# Altium schematic sheet P05 Power2.SchDoc
size 420 x 297 mm
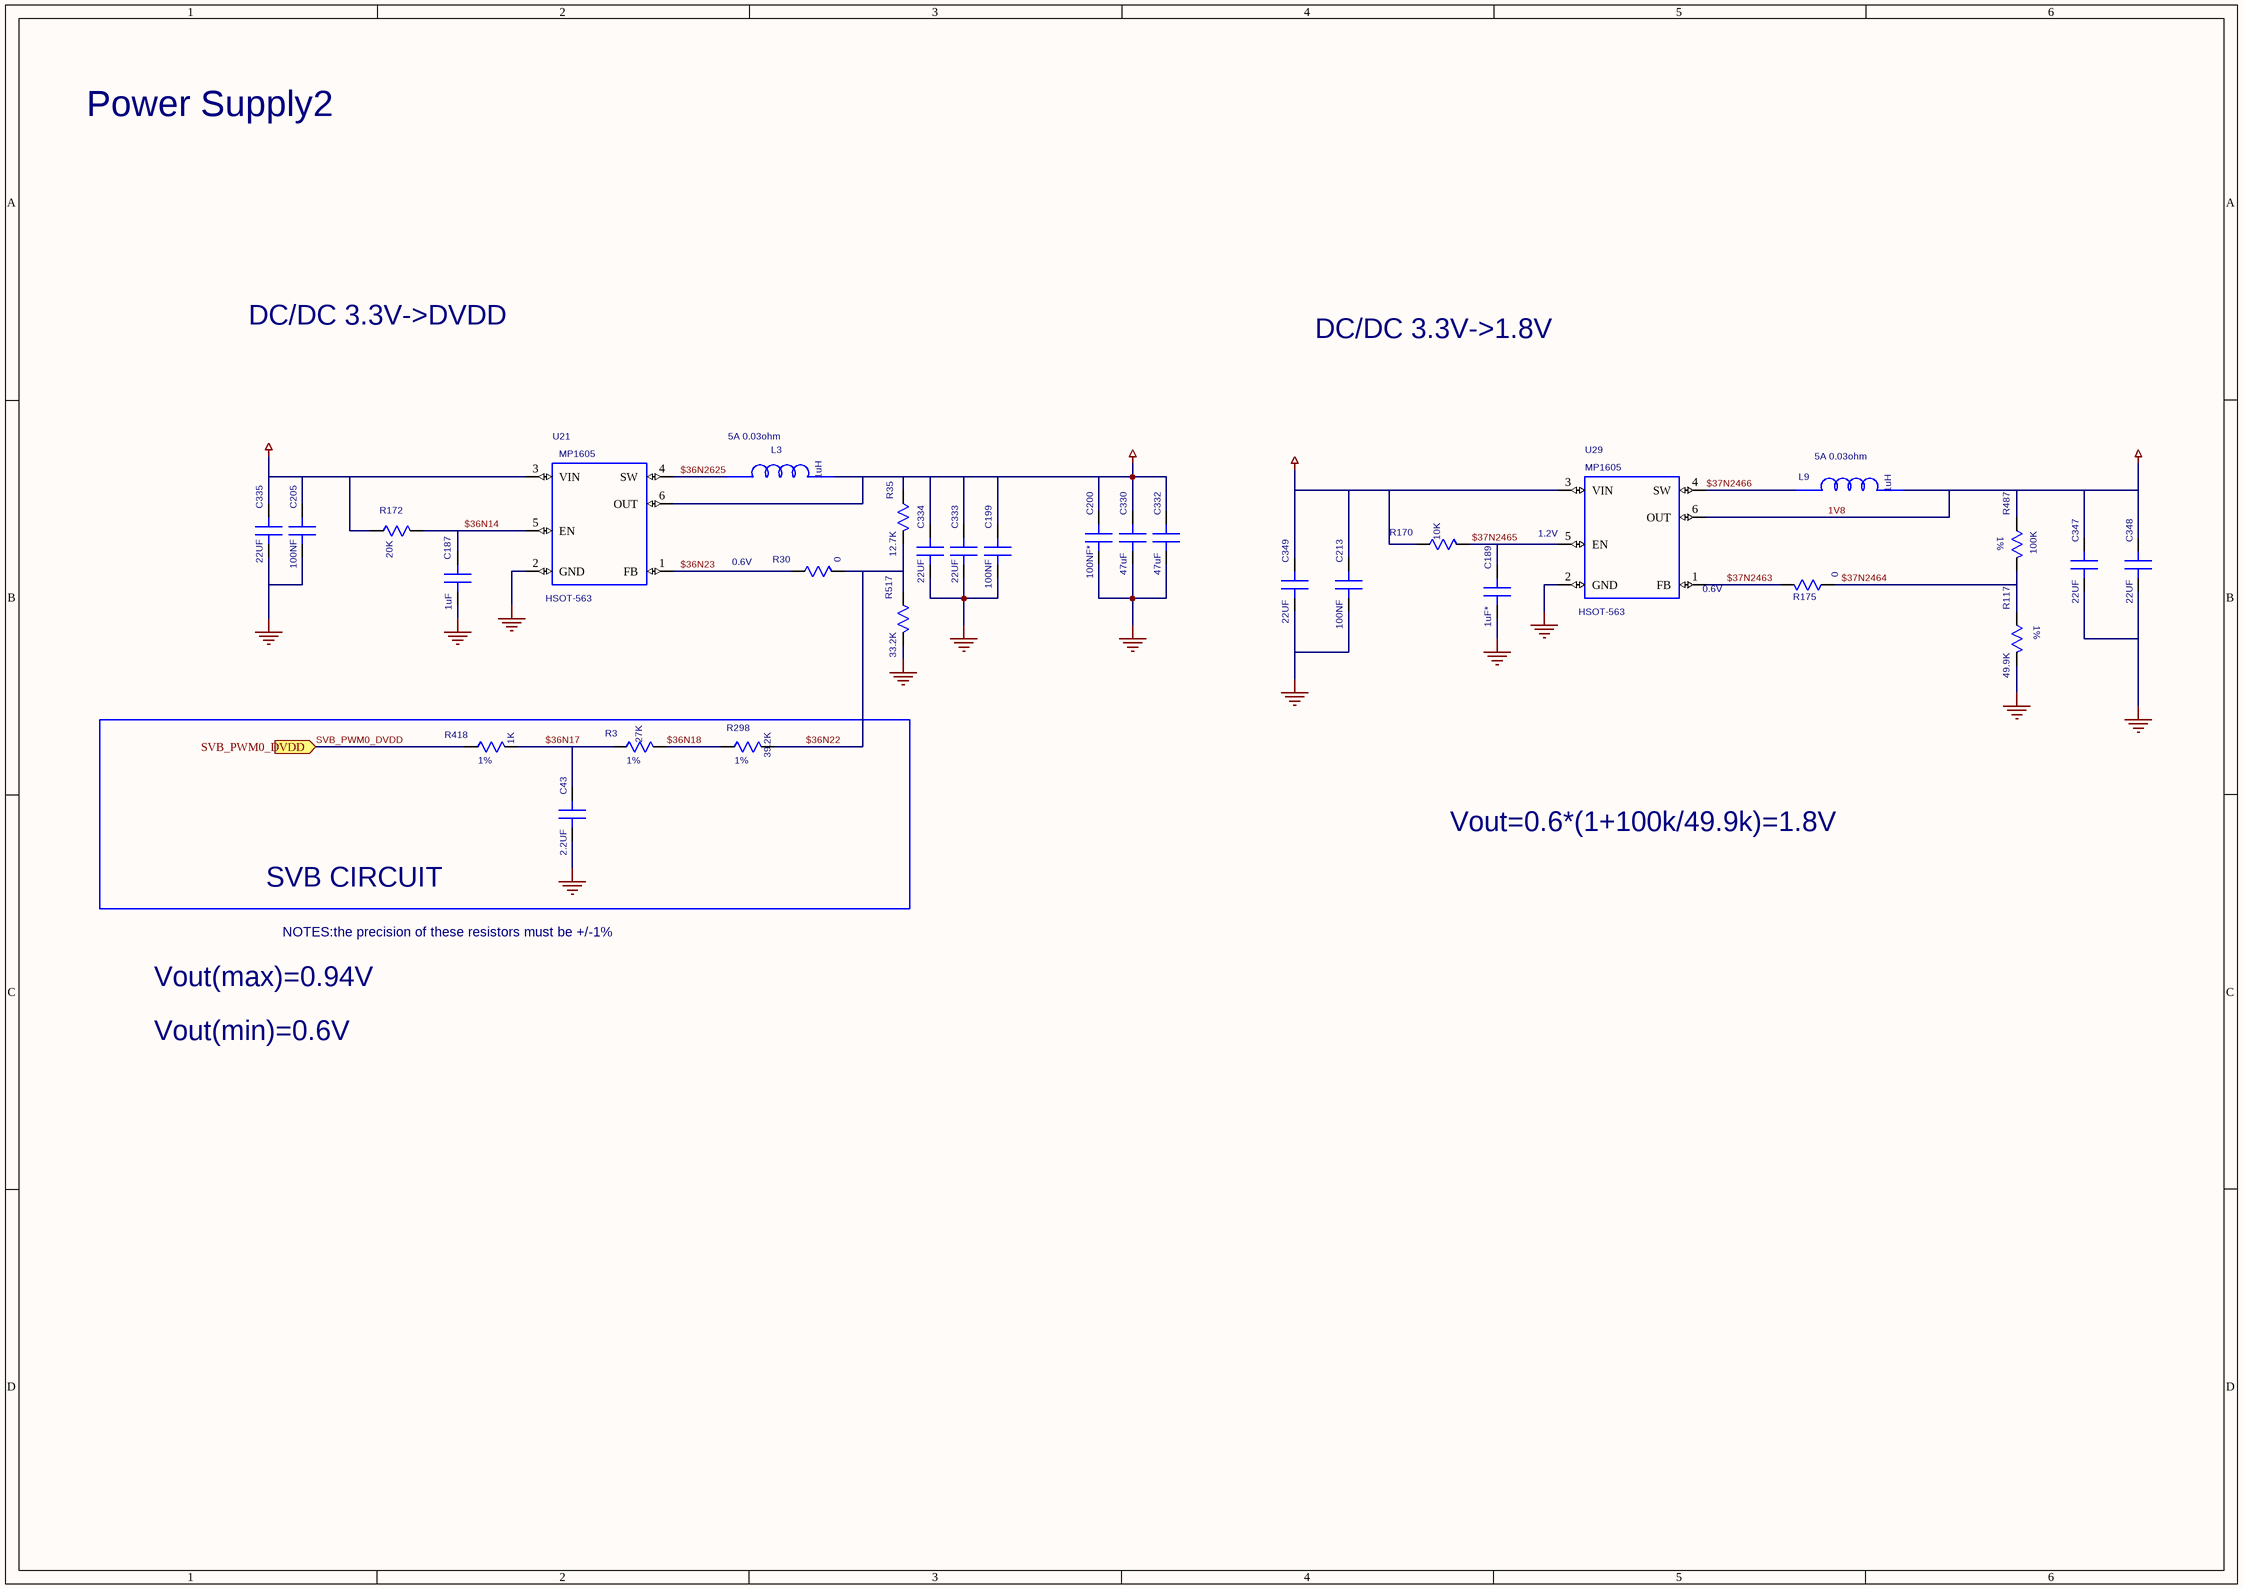
[diagram p0: P05 Power2.SchDoc]

## Parts
C43  2.2UF  [HSC0402]
C187  1uF  [SC0402]
C189  1uF*  [SC0402]
C199  100NF  [SC0402]
C200  100NF*  [SC0402]
C205  100NF  [SC0402]
C213  100NF  [SC0402]
C330  47uF  [SC1206]
C332  47uF  [SC1206]
C333  22UF  [SC1206]
C334  22UF  [SC1206]
C335  22UF  [SC1206]
C347  22UF  [SC1206]
C348  22UF  [SC1206]
C349  22UF  [SC1206]
L3  1uH  [SL1008H]
L9  1uH  [SL1008H]
R3  27K  [SR0603]
R30  0  [SR0402]
R35  12.7K  [SR0603]
R117  49.9K  [SR0402]
R170  10K  [SR0402]
R172  20K  [SR0402]
R175  0  [SR0402]
R298  39.2K  [SR0402]
R418  1K  [SR0402]
R487  100K  [SR0402]
R517  33.2K  [SR0603]
U21  MP1605  [HSOT-563]
U29  MP1605  [HSOT-563]

## Blocks framed on the sheet
SVB CIRCUIT: C43 R3 R298 R418

## Ports
SVB_PWM0_DVDD

## Nets
1V8: C347.1(A) C348.1(A) L9.2(B) R487.1(A) U29.6(OUT)
3V3: C205.1(A) C213.1(A) C335.1(A) C349.1(A) R170.1(A) R172.1(A) U21.3(VIN) U29.3(VIN)
DVDD: C199.1(A) C200.1(A) C330.1(A) C332.1(A) C333.1(A) C334.1(A) L3.2(B) R35.1(A) U21.6(OUT)
GND: C43.2(B) C187.2(B) C189.2(B) C199.2(B) C200.2(B) C205.2(B) C213.2(B) C330.2(B) C332.2(B) C333.2(B) C334.2(B) C335.2(B) C347.2(B) C348.2(B) C349.2(B) R117.2(B) R517.2(B) U21.2(GND) U29.2(GND)
$36N14: C187.1(A) R172.2(B) U21.5(EN)
$36N17: C43.1(A) R3.1(A) R418.2(B)
$36N18: R3.2(B) R298.1(A)
$36N22: R30.2(B) R35.2(B) R298.2(B) R517.1(A)
$36N23: R30.1(A) U21.1(FB)
$36N2625: L3.1(A) U21.4(SW)
$37N2463: R175.2(B) U29.1(FB)
$37N2464: R117.1(A) R175.1(A) R487.2(B)
$37N2465: C189.1(A) R170.2(B) U29.5(EN)
$37N2466: L9.1(A) U29.4(SW)
SVB_PWM0_DVDD: R418.1(A) ; port SVB_PWM0_DVDD

## Notes on the sheet
- Power Supply2
- DC/DC 3.3V->DVDD
- DC/DC 3.3V->1.8V
- (near L3) 5A 0.03ohm
- (near L9) 5A 0.03ohm
- (near R487) 1%
- 0.6V
- (near U29) 1.2V
- (near U29) 0.6V
- (near R117) 1%
- (near R418) 1%
- (near R3) 1%
- (near R298) 1%
- Vout=0.6*(1+100k/49.9k)=1.8V
- NOTES:the precision of these resistors must be +/-1%
- Vout(max)=0.94V
- Vout(min)=0.6V

## Library data of the parts
C43 = C: PARTS: 1; OriginalSymbolOrigin: (0,0); DEVICE: GRM155C70J225KE11D; LEVEL: STD; PINSWAP: (A,B); COMPONENT_HIGH_MAX: 0.7mm; %182%%238%%182%%168%%185%%164%%215%%247%%181%%231%%209%%185%(V): 6.3; CODE: 8071990; %195%%232%%202%%246%: SMD陶瓷电容-6.3V-2200nF-+/-10%-X7S-0402; %208%%161%%192%%224%%195%%251%%179%%198%: SMD陶瓷电容; PKG_TYPE: HSC0402
C187 = C: PARTS: 1; OriginalSymbolOrigin: (0,0); DEVICE: C1005X6S1A105KT000F; LEVEL: STD; PINSWAP: (A,B); %208%%161%%192%%224%%195%%251%%179%%198%: SMD陶瓷电容; COMPONENT_HIGH_MAX: 0.6mm; %182%%238%%182%%168%%185%%164%%215%%247%%181%%231%%209%%185%(V): 10; %195%%232%%202%%246%: SMD陶瓷电容-10V-1000nF-+/-10%-X6S-0402; CODE: 8071747; PKG_TYPE: SC0402
C189 = C: PARTS: 1; OriginalSymbolOrigin: (0,0); DEVICE: C1005X6S1A105KT000F; LEVEL: STD; PINSWAP: (A,B); CODE: 8071747; %195%%232%%202%%246%: SMD陶瓷电容-10V-1000nF-+/-10%-X6S-0402; %182%%238%%182%%168%%185%%164%%215%%247%%181%%231%%209%%185%(V): 10; COMPONENT_HIGH_MAX: 0.6mm; %208%%161%%192%%224%%195%%251%%179%%198%: SMD陶瓷电容; VARIANT_ID: $37I3361; PKG_TYPE: SC0402
C199 = C: PARTS: 1; OriginalSymbolOrigin: (0,0); DEVICE: RMEMK105BJ104KV_FR; LEVEL: STD; PINSWAP: (A,B); COMPONENT_HIGH_MAX: 0.55mm; %182%%238%%182%%168%%185%%164%%215%%247%%181%%231%%209%%185%(V): 16; CODE: 8070614; %195%%232%%202%%246%: SMD陶瓷电容-16V-100nF-+/-10%-X7R-0402-BT; %208%%161%%192%%224%%195%%251%%179%%198%: SMD陶瓷电容; PKG_TYPE: SC0402
C200 = C: PARTS: 1; OriginalSymbolOrigin: (0,0); DEVICE: RMEMK105BJ104KV_FR; LEVEL: STD; PINSWAP: (A,B); %182%%238%%182%%168%%185%%164%%215%%247%%181%%231%%209%%185%(V): 16; COMPONENT_HIGH_MAX: 0.55mm; CODE: 8070614; %195%%232%%202%%246%: SMD陶瓷电容-16V-100nF-+/-10%-X7R-0402-BT; %208%%161%%192%%224%%195%%251%%179%%198%: SMD陶瓷电容; VARIANT_ID: $36I1144; PKG_TYPE: SC0402
C205 = C: PARTS: 1; OriginalSymbolOrigin: (0,0); DEVICE: RMEMK105BJ104KV_FR; LEVEL: STD; PINSWAP: (A,B); %182%%238%%182%%168%%185%%164%%215%%247%%181%%231%%209%%185%(V): 16; COMPONENT_HIGH_MAX: 0.55MM; CODE: 8070614; %195%%232%%202%%246%: SMD陶瓷电容-16V-100NF-+/-10%-X7R-0402-BT; %208%%161%%192%%224%%195%%251%%179%%198%: SMD陶瓷电容; PKG_TYPE: SC0402
C213 = C: PARTS: 1; OriginalSymbolOrigin: (0,0); DEVICE: RMEMK105BJ104KV_FR; LEVEL: STD; PINSWAP: (A,B); %208%%161%%192%%224%%195%%251%%179%%198%: SMD陶瓷电容; CODE: 8070614; %195%%232%%202%%246%: SMD陶瓷电容-16V-100nF-+/-10%-X7R-0402-BT; %182%%238%%182%%168%%185%%164%%215%%247%%181%%231%%209%%185%(V): 16; COMPONENT_HIGH_MAX: 100000000MM; PKG_TYPE: SC0402
C330 C332 = C: PARTS: 1; OriginalSymbolOrigin: (0,0); DEVICE: C3216X6S0J476MTJ00N; LEVEL: STD; PINSWAP: (A,B); CODE: 8071639; %195%%232%%202%%246%: SMD陶瓷电容-6.3V-47000nF-+/-20%-X6S-1206-供电专用; %182%%238%%182%%168%%185%%164%%215%%247%%181%%231%%209%%185%(V): 6.3; COMPONENT_HIGH_MAX: 1.8MM; %208%%161%%192%%224%%195%%251%%179%%198%: SMD陶瓷电容; PKG_TYPE: SC1206
C333 C334 = C: PARTS: 1; OriginalSymbolOrigin: (0,0); DEVICE: CEJMK316B7226ML_T; LEVEL: STD; PINSWAP: (A,B); COMPONENT_HIGH_MAX: 1.8mm; %182%%238%%182%%168%%185%%164%%215%%247%%181%%231%%209%%185%(V): 6.3; CODE: 8070862; %195%%232%%202%%246%: SMD陶瓷电容-6.3V-22000nF-+/-20%-X7R-1206-所有; %208%%161%%192%%224%%195%%251%%179%%198%: SMD陶瓷电容; PKG_TYPE: SC1206
C335 = C: PARTS: 1; OriginalSymbolOrigin: (0,0); DEVICE: CEJMK316B7226ML_T; LEVEL: STD; PINSWAP: (A,B); %182%%238%%182%%168%%185%%164%%215%%247%%181%%231%%209%%185%(V): 6.3; COMPONENT_HIGH_MAX: 1.8mm; CODE: 8070862; %195%%232%%202%%246%: SMD陶瓷电容-6.3V-22000nF-+/-20%-X7R-1206-所有; %208%%161%%192%%224%%195%%251%%179%%198%: SMD陶瓷电容; PKG_TYPE: SC1206
C347 C349 = C: PARTS: 1; OriginalSymbolOrigin: (0,0); DEVICE: CEJMK316B7226ML_T; LEVEL: STD; PINSWAP: (A,B); %208%%161%%192%%224%%195%%251%%179%%198%: SMD陶瓷电容; COMPONENT_HIGH_MAX: 1.8mm; %182%%238%%182%%168%%185%%164%%215%%247%%181%%231%%209%%185%(V): 6.3; %195%%232%%202%%246%: SMD陶瓷电容-6.3V-22000nF-+/-20%-X7R-1206-所有; CODE: 8070862; PKG_TYPE: SC1206
C348 = C: PARTS: 1; OriginalSymbolOrigin: (0,0); DEVICE: CEJMK316B7226ML_T; LEVEL: STD; PINSWAP: (A,B); CODE: 8070862; %195%%232%%202%%246%: SMD陶瓷电容-6.3V-22000nF-+/-20%-X7R-1206-所有; %182%%238%%182%%168%%185%%164%%215%%247%%181%%231%%209%%185%(V): 6.3; COMPONENT_HIGH_MAX: 1.8mm; %208%%161%%192%%224%%195%%251%%179%%198%: SMD陶瓷电容; PKG_TYPE: SC1206
L3 = L: PARTS: 1; DEVICE: DFE252012F-1R0MP2; LEVEL: STD; OriginalSymbolOrigin: (-20,0); COMPONENT_HIGH_MAX: 1.2mm; CODE: 10031575; %195%%232%%202%%246%: 贴片电感器-1uH-+/-20%-0.03ohm-5A-40-2.5*2.0*1.2 mm; %208%%161%%192%%224%%195%%251%%179%%198%: 贴片电感器; PKG_TYPE: SL1008H
L9 = L: PARTS: 1; DEVICE: DFE252012F-1R0MP2; LEVEL: STD; OriginalSymbolOrigin: (-20,0); %208%%161%%192%%224%%195%%251%%179%%198%: 贴片电感器; COMPONENT_HIGH_MAX: 1.2mm; %195%%232%%202%%246%: 贴片电感器-1uH-+/-20%-0.03ohm-5A-40-2.5*2.0*1.2 mm; CODE: 10031575; PKG_TYPE: SL1008H
R3 = R_Dup1: PARTS: 1; OriginalSymbolOrigin: (0,0); PINSWAP: (A,B); DEVICE: RC0603FR_0727KL; LEVEL: STD; CODE: 7091669; %195%%232%%202%%246%: 片式厚膜电阻器-0.1W-27000ohm-+/-1%-0603--供电专用 07090937-供电专用; %182%%238%%182%%168%%185%%166%%194%%202%(W): 0.1; %215%%232%%214%%181%%212%%202%%208%%237%%198%%171%%178%%238%: +/-1%; COMPONENT_HIGH_MAX: 0.55mm; %208%%161%%192%%224%%195%%251%%179%%198%: 片式厚膜电阻器; PKG_TYPE: SR0603
R30 = R_Dup1: PARTS: 1; OriginalSymbolOrigin: (0,0); PINSWAP: (A,B); DEVICE: RC0402JR_070R; LEVEL: STD; %215%%232%%214%%181%%212%%202%%208%%237%%198%%171%%178%%238%: < 50mohm; %182%%238%%182%%168%%185%%166%%194%%202%(W): 0.06; %208%%161%%192%%224%%195%%251%%179%%198%: 片式厚膜电阻器; COMPONENT_HIGH_MAX: 0.4mm; %195%%232%%202%%246%: 片式厚膜电阻器-0.0625W-0ohm-< 50mohm-0402-1A-BT; CODE: 7090800; PKG_TYPE: SR0402
R35 = R_Dup1: PARTS: 1; OriginalSymbolOrigin: (0,0); PINSWAP: (A,B); DEVICE: RC0603FR_0712K7L; LEVEL: STD; %208%%161%%192%%224%%195%%251%%179%%198%: 片式厚膜电阻器; COMPONENT_HIGH_MAX: 0.45mm; %215%%232%%214%%181%%212%%202%%208%%237%%198%%171%%178%%238%: +/-1%; %182%%238%%182%%168%%185%%166%%194%%202%(W): 0.1; %195%%232%%202%%246%: 片式厚膜电阻器-0.1W-12700ohm-+/-1%-0603--供电专用-07090924-供电专用; CODE: 7091716; PKG_TYPE: SR0603
R117 = R_Dup1: PARTS: 1; OriginalSymbolOrigin: (0,0); PINSWAP: (A,B); DEVICE: RC_02W4992FT; LEVEL: STD; CODE: 7091383; %195%%232%%202%%246%: 片式厚膜电阻器-0.0625W-49900ohm-+/-1%-0402-BT; %182%%238%%182%%168%%185%%166%%194%%202%(W): 0.06; %215%%232%%214%%181%%212%%202%%208%%237%%198%%171%%178%%238%: +/-1%; COMPONENT_HIGH_MAX: 0.4MM; %208%%161%%192%%224%%195%%251%%179%%198%: 片式厚膜电阻器; PKG_TYPE: SR0402
R170 = R_Dup1: PARTS: 1; OriginalSymbolOrigin: (0,0); PINSWAP: (A,B); DEVICE: RC_02W103JT; LEVEL: STD; %208%%161%%192%%224%%195%%251%%179%%198%: 片式厚膜电阻器; COMPONENT_HIGH_MAX: 0.4MM; %215%%232%%214%%181%%212%%202%%208%%237%%198%%171%%178%%238%: +/-5%; %182%%238%%182%%168%%185%%166%%194%%202%(W): 0.06; %195%%232%%202%%246%: 片式厚膜电阻器-0.0625W-10000ohm-+/-5%-0402-BT; CODE: 7090815; PKG_TYPE: SR0402
R172 = R_Dup1: PARTS: 1; OriginalSymbolOrigin: (0,0); PINSWAP: (A,B); DEVICE: RC_02W2002FT; LEVEL: STD; %208%%161%%192%%224%%195%%251%%179%%198%: 片式厚膜电阻器; COMPONENT_HIGH_MAX: 99999999mm; %215%%232%%214%%181%%212%%202%%208%%237%%198%%171%%178%%238%: +/-1%; %182%%238%%182%%168%%185%%166%%194%%202%(W): 0.06; %195%%232%%202%%246%: 片式厚膜电阻器-0.0625W-20000ohm-+/-1%-0402-TS16949; CODE: 7091374; PKG_TYPE: SR0402
R175 = R_Dup1: PARTS: 1; OriginalSymbolOrigin: (0,0); PINSWAP: (A,B); DEVICE: RC0402JR_070R; LEVEL: STD; CODE: 7090800; %195%%232%%202%%246%: 片式厚膜电阻器-0.0625W-0OHM-< 50MOHM-0402-1A-BT; %182%%238%%182%%168%%185%%166%%194%%202%(W): 0.06; %215%%232%%214%%181%%212%%202%%208%%237%%198%%171%%178%%238%: < 50MOHM; COMPONENT_HIGH_MAX: 0.4MM; %208%%161%%192%%224%%195%%251%%179%%198%: 片式厚膜电阻器; PKG_TYPE: SR0402
R298 = R_Dup1: PARTS: 1; OriginalSymbolOrigin: (0,0); PINSWAP: (A,B); DEVICE: RC_02W3922FT; LEVEL: STD; CODE: 7091380; %195%%232%%202%%246%: 片式厚膜电阻器-0.0625W-39200ohm-+/-1%-0402; COMPONENT_HIGH_MAX: 0.4mm; %208%%161%%192%%224%%195%%251%%179%%198%: 片式厚膜电阻器; %182%%238%%182%%168%%185%%166%%194%%202%(W): 0.06; %215%%232%%214%%181%%212%%202%%208%%237%%198%%171%%178%%238%: +/-1%; PKG_TYPE: SR0402
R418 = R_Dup1: PARTS: 1; OriginalSymbolOrigin: (0,0); PINSWAP: (A,B); DEVICE: RC0402FR_071KL; LEVEL: STD; %215%%232%%214%%181%%212%%202%%208%%237%%198%%171%%178%%238%: +/-1%; COMPONENT_HIGH_MAX: 0.4MM; %182%%238%%182%%168%%185%%166%%194%%202%(W): 0.06; CODE: 7091282; %195%%232%%202%%246%: 片式厚膜电阻器-0.0625W-1000OHM-+/-1%-0402-BT; %208%%161%%192%%224%%195%%251%%179%%198%: 片式厚膜电阻器; PKG_TYPE: SR0402
R487 = R_Dup1: PARTS: 1; OriginalSymbolOrigin: (0,0); PINSWAP: (A,B); DEVICE: RK73H1ETTP1003F; LEVEL: STD; %208%%161%%192%%224%%195%%251%%179%%198%: 片式厚膜电阻器; COMPONENT_HIGH_MAX: 0.4mm; %215%%232%%214%%181%%212%%202%%208%%237%%198%%171%%178%%238%: +/-1%; %182%%238%%182%%168%%185%%166%%194%%202%(W): 0.06; %195%%232%%202%%246%: 片式厚膜电阻器-0.0625W-100000ohm-+/-1%-0402; CODE: 7090875; PKG_TYPE: SR0402
R517 = R_Dup1: PARTS: 1; OriginalSymbolOrigin: (0,0); PINSWAP: (A,B); DEVICE: RC0603FR_0733K2; LEVEL: STD; %208%%161%%192%%224%%195%%251%%179%%198%: 片式厚膜电阻器; COMPONENT_HIGH_MAX: 0.55mm; %195%%232%%202%%246%: 片式厚膜电阻器-0.1W-33200ohm-+/-1%-0603; CODE: 7090766; %182%%238%%182%%168%%185%%166%%194%%202%(W): 0.1; %215%%232%%214%%181%%212%%202%%208%%237%%198%%171%%178%%238%: +/-1%; PKG_TYPE: SR0603
U21 U29 = MP1605: PARTS: 1; OriginalSymbolOrigin: (0,0); CODE: HBVT4053; LEVEL: STD; DEVICE: MP1605C; PKG_TYPE: HSOT-563